# EAGLE design iwozere (EAGLE 9.6.2)
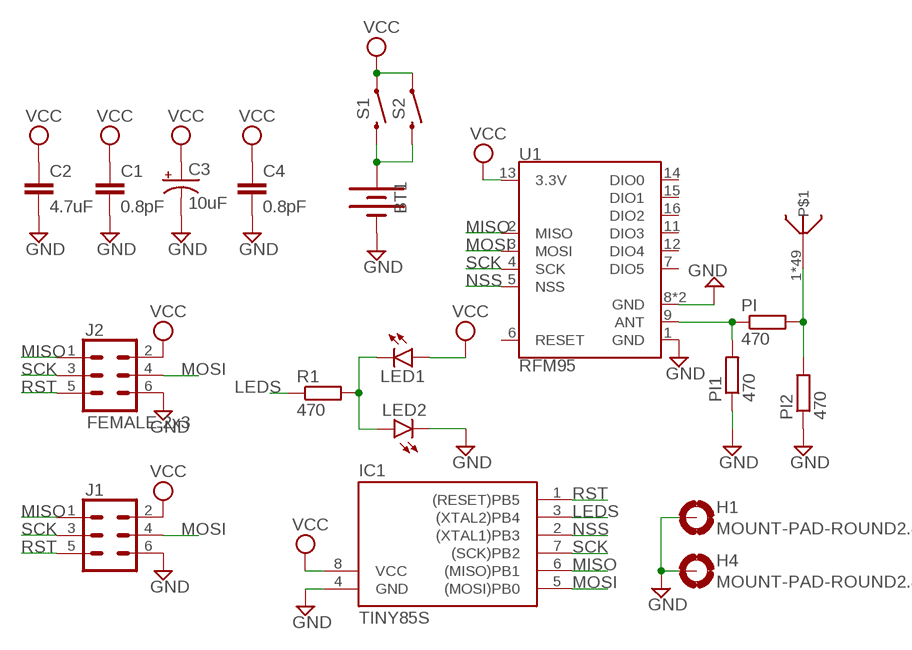
[diagram p0: schematic, sheet 1]

## Parts
BT1  BATTERY-20MM_SMD  [BATTCON_20MM]
C1  0.8pF  0.8PF-0402-50V-0.1PF  [0402]
C2  4.7uF  4.7UF-1206-16V-(+80/-20%)  [1206]
C3  10uF  10UF-POLAR-RADIAL-2.5MM-25V-20%  [CPOL-RADIAL-2.5MM-5MM]
C4  0.8pF  0.8PF-0402-50V-0.1PF  [0402]
H1  MOUNT-PAD-ROUND2.8  [2,8-PAD]
H4  MOUNT-PAD-ROUND2.8  [2,8-PAD]
IC1  TINY85S  [SOIC8]
J1  CONN_03X2SMT  [2X3_SMT_POSTS]
J2  FEMALE 2x3  CONN_03X2FEMALE  [2X3]
LED1  LEDCHIP-LED0603  [CHIP-LED0603]
LED2  LEDCHIP-LED0603  [CHIP-LED0603]
PI  470  R-EU_R0603  [R0603]
PI1  470  R-EU_R0603  [R0603]
PI2  470  R-EU_R0603  [R0603]
R1  470  R-EU_R0603  [R0603]
S1  MOMENTARY-SWITCH-SPST-SMD-RIGHT-ANGLE  [TACTILE_SWITCH_SMD_RIGHT_ANGLE]
S2  MOMENTARY-SWITCH-SPST-PTH-RIGHT-ANGLE-KIT  [TACTILE_SWITCH_PTH_RIGHT_ANGLE_KIT]
U1  RFM95  RFM69HCW-915  [RFM69HCW-XXXS2]
U$1  868MONOPOLEANTENNA  [RESC3216X70N]

## Nets
GND: BT1.2(-) C1.2 C2.2 C3.2(-) C4.2 H1.B2,8(MOUNT) H4.B2,8(MOUNT) IC1.4(GND) J1.6 J2.6 LED2.C PI1.1 PI2.1 U1.1(GND) U1.8(GND) U1.10(GND)
LEDS: IC1.3((XTAL2)PB4) R1.1
MISO: IC1.6((MISO)PB1) J1.1 J2.1 U1.2(MISO)
MOSI: IC1.5((MOSI)PB0) J1.4 J2.4 U1.3(MOSI)
N$1: BT1.1(+) S1.2 S2.2
N$2: PI1.2 PI.1 U1.9(ANT)
N$3: LED1.C LED2.A R1.2
N$4: PI2.2 PI.2 U$1.1 U$1.P$1 U$1.P$2 U$1.P$3 U$1.P$4 U$1.P$5 U$1.P$6 U$1.P$7 U$1.P$8 U$1.P$9 U$1.P$10 U$1.P$11 U$1.P$12 U$1.P$13 U$1.P$14 U$1.P$15 U$1.P$16 U$1.P$17 U$1.P$18 U$1.P$19 U$1.P$20 U$1.P$21 U$1.P$22 U$1.P$23 U$1.P$24 U$1.P$25 U$1.P$26 U$1.P$27 U$1.P$28 U$1.P$29 U$1.P$30 U$1.P$31 U$1.P$32 U$1.P$33 U$1.P$34 U$1.P$35 U$1.P$36 U$1.P$37 U$1.P$38 U$1.P$39 U$1.P$40 U$1.P$41 U$1.P$42 U$1.P$43 U$1.P$44 U$1.P$45 U$1.P$46 U$1.P$47 U$1.P$48
NSS: IC1.2((XTAL1)PB3) U1.5(NSS)
RST: IC1.1((RESET)PB5) J1.5 J2.5
SCK: IC1.7((SCK)PB2) J1.3 J2.3 U1.4(SCK)
VCC: C1.1 C2.1 C3.1(+) C4.1 IC1.8(VCC) J1.2 J2.2 LED1.A S1.1 S2.1 U1.13(3.3V)
Unconnected: U1.6(RESET) U1.7(DIO5) U1.11(DIO3) U1.12(DIO4) U1.14(DIO0) U1.15(DIO1) U1.16(DIO2)

## Library data of the parts
BT1 = SparkFun-Batteries:BATTERY: Battery - Single Cell A variety of battery chemistries, sizes, and footprints. Device List: 20MM_PTH - Coin Cell Battery Holder - 20mm (PTH) <https://www.sparkfun.com/products/783> 6.8MM_PTH - Coin Cell Battery Holder - 6.8MM(SMD) <https://www.digikey.com/product-detail/en/seiko-instruments/MS621FE-FL11E/728-1057-ND/1889208?WT.srch=1&gclid=CNOQ5a6LzdQCFZS2wAodXCkE0g> 12MM_SMD - Coin Cell Battery Holder - 12mm (SMD) <https://www.sparkfun.com/products/10592> 12MM_PTH - Coin Cell Battery Holder - 12mm (PTH) <https://www.sparkfun.com/products/7948> 20MM_SMD - 20mm Coin Cell Battery Holder (SMD) (2 legs) Used on the Big Time Watch Kit <https://www.sparkfun.com/products/11734> 20MM_SMD_4LEGS - Coin Cell Battery Holder - 20mm (SMD) <https://www.sparkfun.com/products/11892> 20MM_SMD_4LEGS_OVERPASTE - Coin Cell Battery Holder - 20mm (SMD) <https://www.sparkfun.com/products/11892> (Over-paste on the legs) 24.5MM_PTH - Coin Cell Battery Holder - 24.5mm (PTH) <https://www.sparkfun.com/products/8863> 9V - 9V Battery Holder - PC Mount Used on the SparkFun SparkPunk Sound Kit <https://www.sparkfun.com/products/11177> and SparkFun SparkPunk Sequencer Kit <https://www.sparkfun.com/products/12707> 18650 - Battery Holder - 18650 (PTH) <https://www.sparkfun.com/products/13113> AA - Battery Holder - 1xAA (PTH) <https://www.sparkfun.com/products/7949> AAA - Battery Holder - 1xAAA (PTH) <https://www.sparkfun.com/products/12718> AA_KIT - Battery Holder - 1xAA (PTH) <https://www.sparkfun.com/products/7949> Special kit package - pads only have exposed copper on one side of the board. AAA_KIT - Battery Holder - 1xAAA (PTH) <https://www.sparkfun.com/products/12718> Special kit package - pads only have exposed copper on one side of the board.; PROD_ID: BATT-11519
C1 C4 = SparkFun-Capacitors:0.8PF: 0.8pF ceramic capacitors A capacitor is a passive two-terminal electrical component used to store electrical energy temporarily in an electric field.; PROD_ID: CAP-13456
C2 = SparkFun-Capacitors:4.7UF: 4.7µF ceramic capacitors A capacitor is a passive two-terminal electrical component used to store electrical energy temporarily in an electric field.; PROD_ID: CAP-10300
C3 = SparkFun-Capacitors:10UF-POLAR: 10.0µF polarized capacitors A capacitor is a passive two-terminal electrical component used to store electrical energy temporarily in an electric field.; PROD_ID: CAP-08440
H1 H4 = holes:MOUNT-PAD-ROUND: MOUNTING PAD, round
IC1 = atmel:TINY85*: MICROCONTROLLER 1 Kbytes FLASH 64 bytes EEPROM; OC_FARNELL: unknown; OC_NEWARK: unknown
J1 = SparkFun-Connectors:CONN_03X2: Multi connection point. Often used as Generic Header-pin footprint for 0.1 inch spaced/style header connections You can populate with any combo of single row headers, but if you'd like an exact match, check these: Header - 2x3 (Male, 0.1") <https://www.sparkfun.com/products/12807> (PRT-12807) Header - 2x3 (Female, 0.1") <https://www.sparkfun.com/products/13010> (PRT-13010) 2x3 Pin Shrouded Header <https://www.sparkfun.com/products/10877> (PRT-10877) On any of the 0.1 inch spaced packages, you can populate with these: Break Away Headers - Straight <https://www.sparkfun.com/products/116> (PRT-00116) Break Away Male Headers - Right Angle <https://www.sparkfun.com/products/553> (PRT-00553) Female Headers <https://www.sparkfun.com/products/115> (PRT-00115) Break Away Headers - Machine Pin <https://www.sparkfun.com/products/117> (PRT-00117) Break Away Female Headers - Swiss Machine Pin <https://www.sparkfun.com/products/743> (PRT-00743) Special note: the shrouded connector mates well with our 3x2 ribbon cables: Ribbon Crimp Connector - 6-pin (2x3, Female) <https://www.sparkfun.com/products/10651> (PRT-10651) Ribbon Cable - 6 wire (15ft) <https://www.sparkfun.com/products/10646> (PRT-10646); PROD_ID: CONN-11415
J2 = SparkFun-Connectors:CONN_03X2: Multi connection point. Often used as Generic Header-pin footprint for 0.1 inch spaced/style header connections You can populate with any combo of single row headers, but if you'd like an exact match, check these: Header - 2x3 (Male, 0.1") <https://www.sparkfun.com/products/12807> (PRT-12807) Header - 2x3 (Female, 0.1") <https://www.sparkfun.com/products/13010> (PRT-13010) 2x3 Pin Shrouded Header <https://www.sparkfun.com/products/10877> (PRT-10877) On any of the 0.1 inch spaced packages, you can populate with these: Break Away Headers - Straight <https://www.sparkfun.com/products/116> (PRT-00116) Break Away Male Headers - Right Angle <https://www.sparkfun.com/products/553> (PRT-00553) Female Headers <https://www.sparkfun.com/products/115> (PRT-00115) Break Away Headers - Machine Pin <https://www.sparkfun.com/products/117> (PRT-00117) Break Away Female Headers - Swiss Machine Pin <https://www.sparkfun.com/products/743> (PRT-00743) Special note: the shrouded connector mates well with our 3x2 ribbon cables: Ribbon Crimp Connector - 6-pin (2x3, Female) <https://www.sparkfun.com/products/10651> (PRT-10651) Ribbon Cable - 6 wire (15ft) <https://www.sparkfun.com/products/10646> (PRT-10646); PROD_ID: CONN-11566
LED1 LED2 = led:LED: LED OSRAM: - CHIPLED LG R971, LG N971, LY N971, LG Q971, LY Q971, LO R971, LY R971 LH N974, LH R974 LS Q976, LO Q976, LY Q976 LO Q996 - Hyper CHIPLED LW Q18S LB Q993, LB Q99A, LB R99A - SideLED LS A670, LO A670, LY A670, LG A670, LP A670 LB A673, LV A673, LT A673, LW A673 LH A674 LY A675 LS A676, LA A676, LO A676, LY A676, LW A676 LS A679, LY A679, LG A679 - Hyper Micro SIDELED® LS Y876, LA Y876, LO Y876, LY Y876 LT Y87S - SmartLED LW L88C, LW L88S LB L89C, LB L89S, LG L890 LS L89K, LO L89K, LY L89K LS L896, LA L896, LO L896, LY L896 - TOPLED LS T670, LO T670, LY T670, LG T670, LP T670 LSG T670, LSP T670, LSY T670, LOP T670, LYG T670 LG T671, LOG T671, LSG T671 LB T673, LV T673, LT T673, LW T673 LH T674 LS T676, LA T676, LO T676, LY T676, LB T676, LH T676, LSB T676, LW T676 LB T67C, LV T67C, LT T67C, LS T67K, LO T67K, LY T67K, LW E67C LS E67B, LA E67B, LO E67B, LY E67B, LB E67C, LV E67C, LT E67C LW T67C LS T679, LY T679, LG T679 LS T770, LO T770, LY T770, LG T770, LP T770 LB T773, LV T773, LT T773, LW T773 LH T774 LS E675, LA E675, LY E675, LS T675 LS T776, LA T776, LO T776, LY T776, LB T776 LHGB T686 LT T68C, LB T68C - Hyper Mini TOPLED® LB M676 - Mini TOPLED Santana® LG M470 LS M47K, LO M47K, LY M47K Source: http://www.osram.convergy.de LUXEON: - LUMILED® LXK2-PW12-R00, LXK2-PW12-S00, LXK2-PW14-U00, LXK2-PW14-V00 LXK2-PM12-R00, LXK2-PM12-S00, LXK2-PM14-U00 LXK2-PE12-Q00, LXK2-PE12-R00, LXK2-PE12-S00, LXK2-PE14-T00, LXK2-PE14-U00 LXK2-PB12-K00, LXK2-PB12-L00, LXK2-PB12-M00, LXK2-PB14-N00, LXK2-PB14-P00, LXK2-PB14-Q00 LXK2-PR12-L00, LXK2-PR12-M00, LXK2-PR14-Q00, LXK2-PR14-R00 LXK2-PD12-Q00, LXK2-PD12-R00, LXK2-PD12-S00 LXK2-PH12-R00, LXK2-PH12-S00 LXK2-PL12-P00, LXK2-PL12-Q00, LXK2-PL12-R00 Source: www.luxeon.com KINGBRIGHT: KA-3528ASYC Source: www.kingbright.com
PI PI1 PI2 R1 = rcl:R-EU_: RESISTOR, European symbol; SPICEPREFIX: R
S1 = SparkFun-Switches:MOMENTARY-SWITCH-SPST: Momentary Switch (Pushbutton) - SPST Normally-open (NO) SPST momentary switches (buttons, pushbuttons). Variants PTH-12MM - 12mm square, through-hole Momentary Pushbutton Switch - 12mm Square <https://www.sparkfun.com/products/9190> (COM-09190) PTH-6.0MM, PTH-6.0MM-KIT - 6.0mm square, through-hole Mini Pushbutton Switch <https://www.sparkfun.com/products/97> (COM-00097) KIT package intended for soldering kit's - only one side of pads' copper is exposed. PTH-RIGHT-ANGLE-KIT - Right-angle, through-hole Right Angle Tactile Button <https://www.sparkfun.com/products/10791> - Used on SparkFun BigTime Watch Kit <https://www.sparkfun.com/products/11734> SMD-12MM - 12mm square, surface-mount Tactile Button - SMD (12mm) <https://www.sparkfun.com/products/12993> (COM-12993) Used on SparkFun PicoBoard <https://www.sparkfun.com/products/11888> SMD-4.5MM - 4.5mm Square Trackball Switch Used on SparkFun Blackberry Trackballer Breakout <https://www.sparkfun.com/products/13169> SMD-4.6MMX2.8MM - 4.60mm x 2.80mm, surface mount Used on SparkFun SAMD21 Mini Breakout <https://www.sparkfun.com/products/13664> SMD-5.2MM, SMD-5.2-REDUNDANT - 5.2mm square, surface-mount Mini Pushbutton Switch - SMD <https://www.sparkfun.com/products/8720> (COM-08720) Used on Arduino Pro Mini <https://www.sparkfun.com/products/11114> REDUNDANT package connects both switch circuits together SMD-6.0X3.5MM - 6.0 x 3.5mm, surface mount Momentary Reset Switch SMD <https://www.sparkfun.com/products/8229> (COM-08229) SMD-6.2MM-TALL - 6.2mm square, surface mount Tactile Button - SMD (6mm) <https://www.sparkfun.com/products/12992> Used on SparkFun Digital Sandbox <https://www.sparkfun.com/products/12651> SMD-RIGHT-ANGLE - Right-angle, surface mount Used on SparkFun Block for Intel® Edison - Arduino <https://www.sparkfun.com/products/13036>; PROD_ID: COMP-12265
S2 = SparkFun-Switches:MOMENTARY-SWITCH-SPST: Momentary Switch (Pushbutton) - SPST Normally-open (NO) SPST momentary switches (buttons, pushbuttons). Variants PTH-12MM - 12mm square, through-hole Momentary Pushbutton Switch - 12mm Square <https://www.sparkfun.com/products/9190> (COM-09190) PTH-6.0MM, PTH-6.0MM-KIT - 6.0mm square, through-hole Mini Pushbutton Switch <https://www.sparkfun.com/products/97> (COM-00097) KIT package intended for soldering kit's - only one side of pads' copper is exposed. PTH-RIGHT-ANGLE-KIT - Right-angle, through-hole Right Angle Tactile Button <https://www.sparkfun.com/products/10791> - Used on SparkFun BigTime Watch Kit <https://www.sparkfun.com/products/11734> SMD-12MM - 12mm square, surface-mount Tactile Button - SMD (12mm) <https://www.sparkfun.com/products/12993> (COM-12993) Used on SparkFun PicoBoard <https://www.sparkfun.com/products/11888> SMD-4.5MM - 4.5mm Square Trackball Switch Used on SparkFun Blackberry Trackballer Breakout <https://www.sparkfun.com/products/13169> SMD-4.6MMX2.8MM - 4.60mm x 2.80mm, surface mount Used on SparkFun SAMD21 Mini Breakout <https://www.sparkfun.com/products/13664> SMD-5.2MM, SMD-5.2-REDUNDANT - 5.2mm square, surface-mount Mini Pushbutton Switch - SMD <https://www.sparkfun.com/products/8720> (COM-08720) Used on Arduino Pro Mini <https://www.sparkfun.com/products/11114> REDUNDANT package connects both switch circuits together SMD-6.0X3.5MM - 6.0 x 3.5mm, surface mount Momentary Reset Switch SMD <https://www.sparkfun.com/products/8229> (COM-08229) SMD-6.2MM-TALL - 6.2mm square, surface mount Tactile Button - SMD (6mm) <https://www.sparkfun.com/products/12992> Used on SparkFun Digital Sandbox <https://www.sparkfun.com/products/12651> SMD-RIGHT-ANGLE - Right-angle, surface mount Used on SparkFun Block for Intel® Edison - Arduino <https://www.sparkfun.com/products/13036>; PROD_ID: CONN-10672; SF_SKU: COM-10791
U1 = SparkFun-RF:RFM69H: Hope RF RFM69H ISM Transceiver Module The RFM69H is a transceiver module capable of operation over a wide frequency range, including the 315,433,868 and 915MHz license-free ISM (Industry Scientific and Medical) frequency bands. All major RF communication parameters are programmable and most of them can be dynamically set. The RFM69H offers the unique advantage of programmable narrow-band and wide- band communication modes. The RFM69H is optimized for low power consumption while offering high RF output power and channelized operation.Compliance ETSI and FCC regulations. Datasheet <http://www.hoperf.cn/upload/docs/RF/SX/RFM69H_DataSheet_v1.3.pdf> SparkFun Products RFM69HCW Wireless Transceiver - 915MHz <https://www.sparkfun.com/products/13909> (COM-13909) RFM69HCW Wireless Transceiver - 434MHz <https://www.sparkfun.com/products/13910> (COM-13910) SparkFun RFM69 Breakout (915MHz) <https://www.sparkfun.com/products/12775> (WRL-12775) SparkFun RFM69 Breakout (434MHz) <https://www.sparkfun.com/products/12823> (WRL-12823); PROD_ID: IC-11997; VALUE: 915MHz
U$1 = antennas:868MONOPOLE

## Board
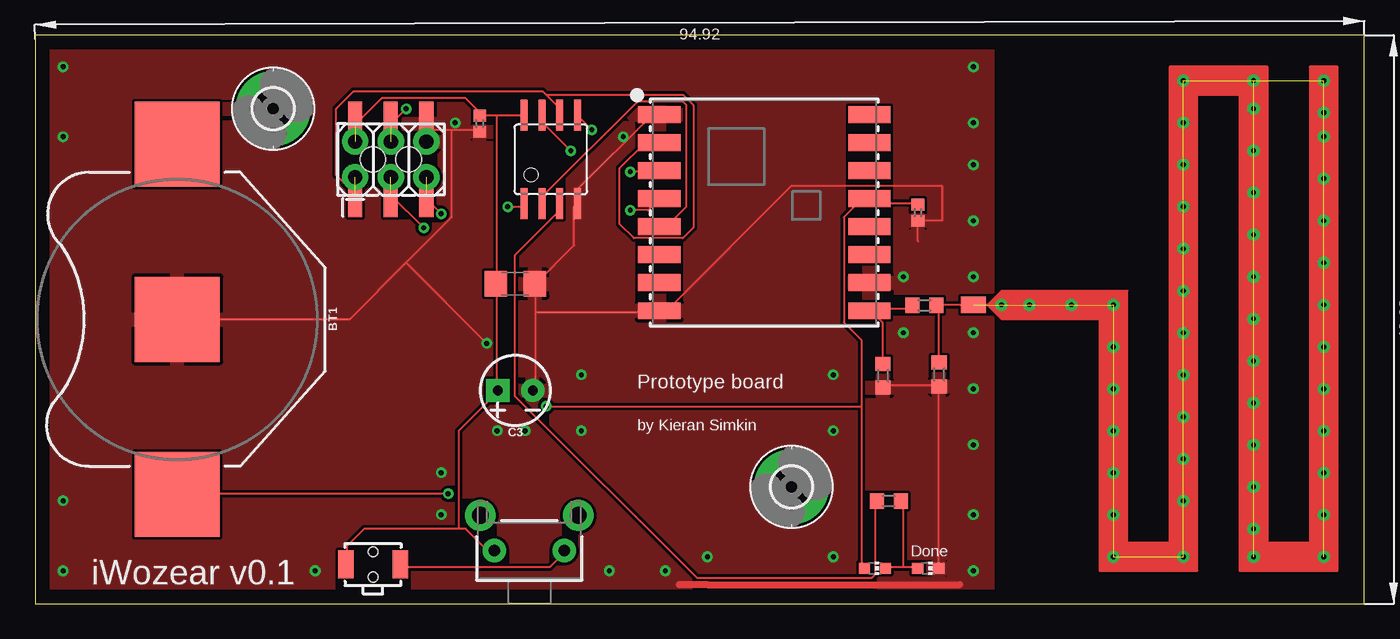
[diagram p1: board, top side]
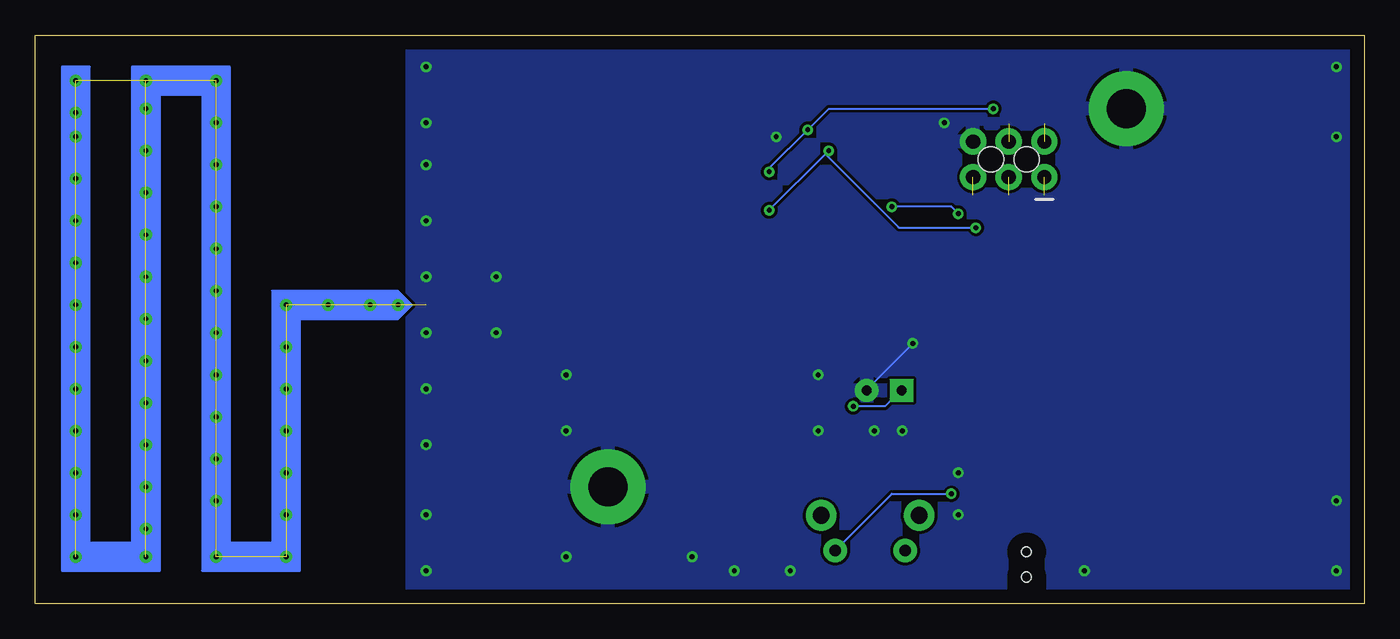
[diagram p2: board, bottom side, seen from below]

Size 94.92 x 40.63 mm. Coordinates in mm from the lower left corner, seen from the top.
Outline: 0,0 94.92,0 94.92,40.63 0,40.63 0,0
Copper layers (1*16): Top 0.035mm / dielectric 1.5mm / Bottom 0.035mm
Design rules "default": minimum track width 6mil, minimum drill 0.35mm, track to track 6mil, track to pad 6mil, pad to pad 6mil, via to via 6mil, smd to smd 6mil, copper to edge 40mil, drill to drill 6mil, minimum pad ring 10mil, minimum via ring 8mil, stop-mask expansion 4mil, vias tented up to drill 0mil, thermal gap 10mil

### Footprints (pad centres in the part's own frame; a part is rotated, then mirrored left to right if it is on the bottom)
BATTCON_20MM = smd 6.07 x 6.07: 1 -12.5,0; 2 0,0; 3 12.5,0
0402 = smd 0.85 x 0.9: 1 -0.58,0; 2 0.58,0
1206 = smd 1.6 x 1.8: 1 -1.4,0; 2 1.4,0
CPOL-RADIAL-2.5MM-5MM = drill 0.7 pad 1.651 square: 1 1.25,0 | drill 0.7 pad 1.651: 2 -1.25,0
2,8-PAD = drill 2.8 pad 5.334: B2,8 0,0
SOIC8 = smd 0.5 x 2.2: 1 -1.905,-3.154; 2 -0.645,-3.154; 3 0.625,-3.154; 4 1.895,-3.154; 5 1.905,3.154; 6 0.635,3.154; 7 -0.635,3.154; 8 -1.905,3.154
2X3_SMT_POSTS = smd 1 x 3.17: 1 -2.54,-2.54; 2 -2.54,2.54; 3 0,-2.54; 4 0,2.54; 5 2.54,-2.54; 6 2.54,2.54 | hole 1.8: -1.27,0; 1.27,0
2X3 = drill 1.016 pad 1.88: 1 0,0; 2 0,2.54; 3 2.54,0; 4 2.54,2.54; 5 5.08,0; 6 5.08,2.54
CHIP-LED0603 = smd 0.8 x 0.8: A 0,-0.75; C 0,0.75
R0603 = smd 1 x 1.1: 1 -0.85,0; 2 0.85,0
TACTILE_SWITCH_SMD_RIGHT_ANGLE = smd 1.1 x 2: 1 -1.95,0; 2 1.95,0 | hole 0.7: 0,0.9; 0,-0.9
TACTILE_SWITCH_PTH_RIGHT_ANGLE_KIT = drill 0.8 pad 1.7: 1 -2.5,0; 2 2.5,0 | drill 1.2 pad 2.2: ANCHOR1 -3.5,2.5; ANCHOR2 3.5,2.5
RFM69HCW-XXXS2 = smd 3 x 1.2: 1 -7.5,7; 2 -7.5,5; 3 -7.5,3; 4 -7.5,1; 5 -7.5,-1; 6 -7.5,-3; 7 -7.5,-5; 8 -7.5,-7; 9 7.5,-7; 10 7.5,-5; 11 7.5,-3; 12 7.5,-1; 13 7.5,1; 14 7.5,3; 15 7.5,5; 16 7.5,7
RESC3216X70N = smd 1.165 x 1.815: 1 -1,0 | drill 0.35: P$1 -1,2; P$2 -1,10; P$3 -17,15; P$4 -17,20; P$5 17,15; P$6 17,10; P$7 17,20; P$8 17,25; P$9 -17,25; P$10 -1,4; P$11 -1,7; P$12 2,10; P$13 5,10; P$14 8,10; P$15 11,10; P$16 14,10; P$17 13,15; P$18 10,15; P$19 7,15; P$20 4,15; P$21 1,15; P$22 -2,15; P$23 -5,15; P$24 -8,15; P$25 -11,15; P$26 -14,15; P$27 -15,20; P$28 -12,20; P$29 -9,20; P$30 -6,20; P$31 -3,20; P$32 0,20; P$33 3,20; P$34 6,20; P$35 9,20; P$36 12,20; P$37 15,20; P$38 -14.73,25; P$39 -13,25; P$40 -10,25; P$41 -7,25; P$42 -4,25; P$43 -1,25; P$44 2,25; P$45 5,25; P$46 8,25; P$47 11,25; P$48 14,25

### Placement (x,y rotation side)
BT1  10.16,20.32 90 top
C1  31.75,34.29 270 top
C2  34.29,22.86 0 top
C3  34.29,15.24 180 top
C4  63.04,27.94 270 top
H1  54,8.36 0 top
H4  17,35.36 0 top
IC1  36.83,31.75 0 top
J1  25.4,31.75 0 top
J2  22.86,30.48 0 top
LED1  59.96,2.54 270 top
LED2  63.77,2.54 270 top
PI  63.5,21.32 0 top
PI1  60.54,16.3 90 top
PI2  64.54,16.38 90 top
R1  60.96,7.35 0 top
S1  24.13,2.81 0 top
S2  35.29,3.81 0 top
U1  52.07,27.94 0 top
U$1  67,20.36 270 top

### Tracks (layer width: path | path; a pad name or v marks a point on that pad's centre or on a via)
GND  (via drill 0.35)
  Top 0.152: 29.75,33.86 28.25,33.86 28,34.11 J1.6 | 29.75,33.86 31.75,33.86 C1.2 | 29.75,33.86 29.75,27.61 26.5,24.36 | 26.5,24.36 22.5,20.36 10.25,20.36 BT1.2 | 63.04,25.9 C4.2 64.75,27.36 64.75,29.86 54,29.86 45.25,21.11 44.75,21.11 U1.8 44.5,20.86 35.75,20.86 | 60.25,23.11 59.75,23.11 U1.10 | LED2.C 64.5,2.61 64.5,15.36 PI2.1 64.5,15.61 60.75,15.61 PI1.1 | 35.75,20.86 35.75,15.36 C3.2 | 35.75,20.86 35.75,22.86 | 35.75,22.86 38.5,25.61 38.5,28.36 IC1.4 38.75,28.61 38.75,29.61 44,34.86 44.5,34.86 U1.1 | 35.75,22.86 C2.2 | v32.25,18.61 26.5,24.36
  Top 0.5: 48,1.36 66,1.36
  Top 0.508: 48,1.36 46,1.36
  Bottom 0.152: v32.25,18.61 35.5,15.36 C3.2
  other vias: 67,23.36 67,19.36 67,38.36 67,2.36 67,27.36 67,15.36 67,11.36 67,6.36 67,34.36 67,31.36 2,38.36 2,2.36 2,33.36 2,7.36 57,16.36 39,16.36 20,2.36 29,9.36 39,12.36 57,12.36 48,3.36 57,3.36 33,12.36 35,12.36 45,2.36 41,2.36 62,19.36 62,23.36 42,33.36 29,6.36 30,34.36
  pour Top (isolate 0.2): 0,40.36 68,40.36 68,0.36 0,0.36
  pour Bottom (isolate 0.2): 0,40.36 68,40.36 68,0.36 0,0.36
  pour Top (isolate 0.2): 58,13.36 58,2.36 48,2.36 37,13.36
  pour Top (isolate 0.2): 46,1.36 28,1.36 28,2.36 40,2.36 40,4.36 41,5.36 41,6.36 39.19,8.17 arc45 38.74,8.36 38,8.36 37,7.36 36,7.36 35,8.36 34,9.36 31,9.36 31,11.36 31.81,12.17 arc45 32,12.62 32,13.36 35,13.36 47,1.36
LEDS
  Top 0.152: R1.1 60,7.11 60,2.11 59.75,1.86 47.25,1.86 34.25,14.86 34.25,24.86 37.25,27.86 37.25,28.36 IC1.3
MISO  (1 unrouted)
  Top 0.152: 36.5,36.36 36.25,36.61 22.75,36.61 21.5,35.36 21.5,30.61 22.75,29.36 J1.1 | 36.5,36.36 37.25,35.61 37.25,35.11 IC1.6 | 36.5,36.36 46.25,36.36 47,35.61 47,26.86 46.25,26.11 42.75,26.11 41.75,27.11 41.75,31.11 43.5,32.86 44.5,32.86 U1.2
MOSI  (via drill 0.35)  (1 unrouted)
  Top 0.152: v39.75,33.86 38.75,34.86 IC1.5 | v42.5,30.86 44.5,30.86 U1.3 | v26.5,35.36 25.5,34.36 J1.4
  Bottom 0.152: v42.5,30.86 42.5,31.11 v39.75,33.86 38.25,35.36 v26.5,35.36
N$1  (via drill 0.35)
  Top 0.152: S1.2 26.25,2.61 36.75,2.61 37.75,3.61 S2.2 | v29.5,7.86 10.25,7.86 BT1.1
  Bottom 0.152: v29.5,7.86 33.75,7.86 37.75,3.86 S2.2
N$2
  Top 0.152: PI1.2 60.5,17.36 60.5,20.11 59.75,20.86 U1.9 59.75,21.11 62.5,21.11 PI.1
N$3
  Top 0.152: 62,2.61 63,2.61 LED2.A | 62,2.61 60.75,2.61 LED1.C | 62,2.61 62,7.11 R1.2
N$4  (49 unrouted)
  Top 0.152: 69.25,21.36 64.5,21.36 PI.2 64.5,21.11 64.5,17.36 PI2.2
NSS
  Top 0.152: IC1.2 36.25,28.61 36.25,29.11 43,35.86 46.25,35.86 46.5,35.61 46.5,28.36 45.25,27.11 44.75,27.11 U1.5
RST  (via drill 0.35)  (1 unrouted)
  Top 0.152: v33.75,28.36 34.75,28.36 IC1.1 | v29,27.86 27.75,29.11 J1.5
  Bottom 0.152: v33.75,28.36 29.5,28.36 v29,27.86
SCK  (via drill 0.35)  (1 unrouted)
  Top 0.152: v38.25,32.36 36.25,34.36 36.25,34.86 IC1.7 | v42.5,28.11 43.75,28.11 44.5,28.86 U1.4 | v27.75,26.86 J1.3
  Bottom 0.152: v42.5,28.11 38.5,32.11 | v27.75,26.86 33.25,26.86 38.5,32.11 | 38.5,32.11 v38.25,32.36
VCC  (via drill 0.35)  (1 unrouted)
  Top 0.152: 59,14.11 59,18.86 57.75,20.11 57.75,27.61 58.75,28.61 | 59,14.11 59,2.61 LED1.A | 58.75,28.61 59,28.86 59.5,28.86 U1.13 58.75,28.61 | 58.75,28.61 63,28.61 C4.1 | 30.25,5.36 30.75,5.36 32.25,3.86 32.75,3.86 S2.1 | 30.25,5.36 23.5,5.36 22.25,4.11 22.25,2.86 S1.1 | 33,34.86 34.75,34.86 IC1.8 | 33,34.86 C1.1 31.75,35.11 30.75,36.11 24.75,36.11 23,34.36 J1.2 | 33,22.86 33,15.36 C3.1 33,15.11 30.25,12.36 30.25,5.36 | 33,22.86 33,34.86 | 33,22.86 C2.1 | v36.5,14.11 59,14.11
  Bottom 0.152: v36.5,14.11 34.25,14.11 33.25,15.11 C3.1

### Text on the board
tPlace: Prototype board | by Kieran Simkin | Done | iWozear v0.1